# EAGLE design MQ303A + EEPROM v3.0 - para testes (EAGLE 9.6.2)
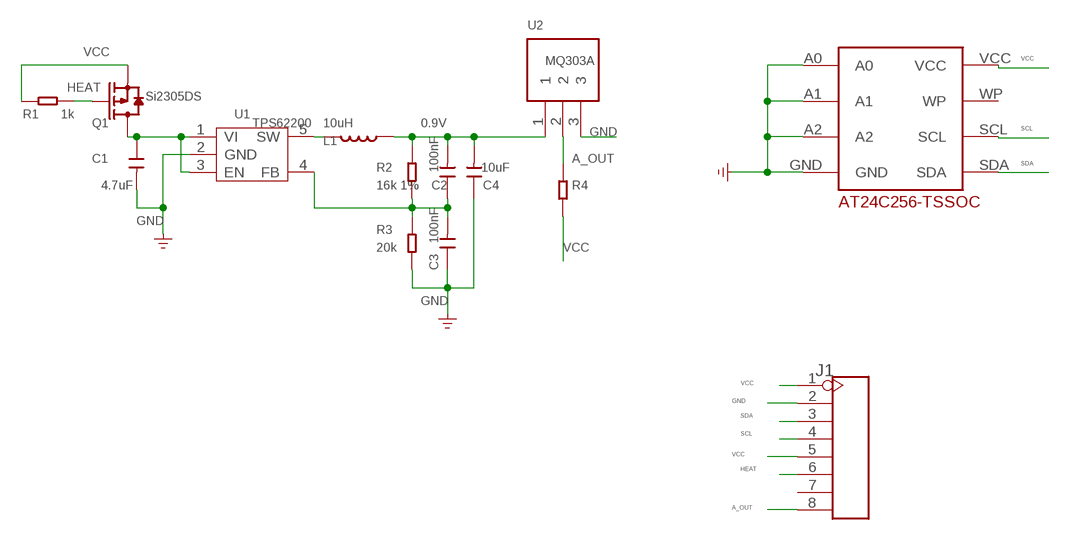
[diagram p0: schematic, sheet 1]

## Parts
C1  4.7uF  C-0805  [C0805]
C2  100nF  C-0603  [C0603]
C3  100nF  C-0603  [C0603]
C4  10uF  C-0805  [C0805]
J1  HEADER-8P-2.54  [8P-2.54]
L1  10uH  L'PIO73'  [PIO73]
Q1  Si2305DS  MOSFET-P'SI2323CDS/SI2305DS<BR>'  [SOT23]
R1  1k  R-0603  [R0603]
R2  16k 1%  R-0603  [R0603]
R3  20k  R-0603  [R0603]
R4  R-0603  [R0603]
U1  TPS62200  TPS62200DBV  [SOT23-5]
U2  MQ303A  [MQ303A]
U$1  DECADE-AT24C256-10TI-2.7  [DECADE-AT24CXX]

## Nets
0.9V: C2.2 C4.2 L1.2 R2.1 U2.1
A_OUT: J1.8 R4.1 U2.2
GND: C1.2 C3.1 C4.1 J1.2 R3.2 U1.2(GND) U2.3 U$1.A0 U$1.A1 U$1.A2 U$1.GND
HEAT: J1.6 Q1.1(G) R1.1
N$1: C1.1 Q1.3(D) U1.1(VI) U1.3(EN)
N$2: L1.1 U1.5(SW)
N$3: C2.1 C3.2 R2.2 R3.1 U1.4(FB)
SCL: J1.4 U$1.SCL
SDA: J1.3 U$1.SDA
VCC: J1.1 J1.5 Q1.2(S) R1.2 R4.2 U$1.VCC
Unconnected: J1.7 U$1.WP

## Library data of the parts
C1-C4 = Discrete:C*: Ceramic Capacitors
J1 = Connector:HEADER-8P
L1 = Discrete:L*
Q1 = Discrete:MOSFET-P
R1-R4 = Discrete:R*
U1 = IC:TPS62200: High-Efficiency,SOT23 STEP-DOWN,DC-DC Converter
U2 = MQ303A:MQ303A
U$1 = DECADE-libraries20151104:DECADE-AT24C256-10TI-2.7

## Board
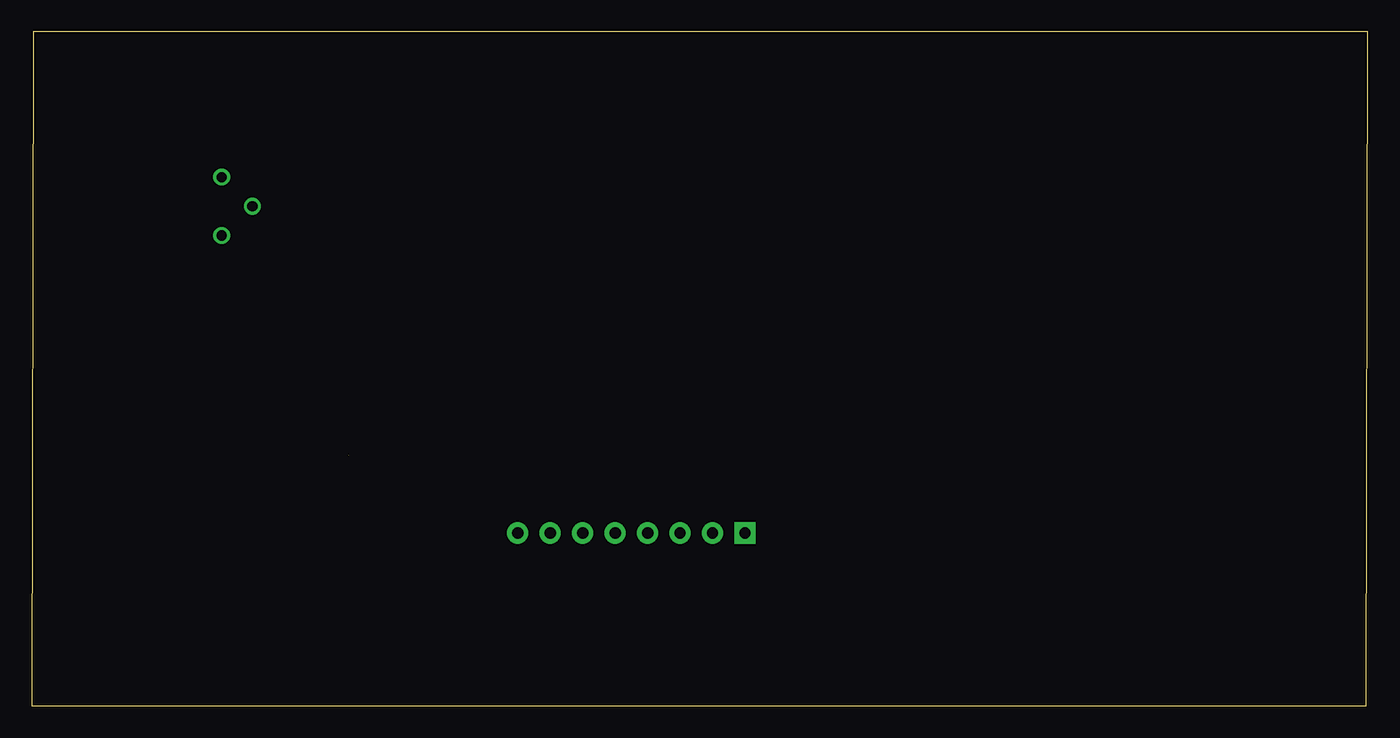
[diagram p1: board, top side]
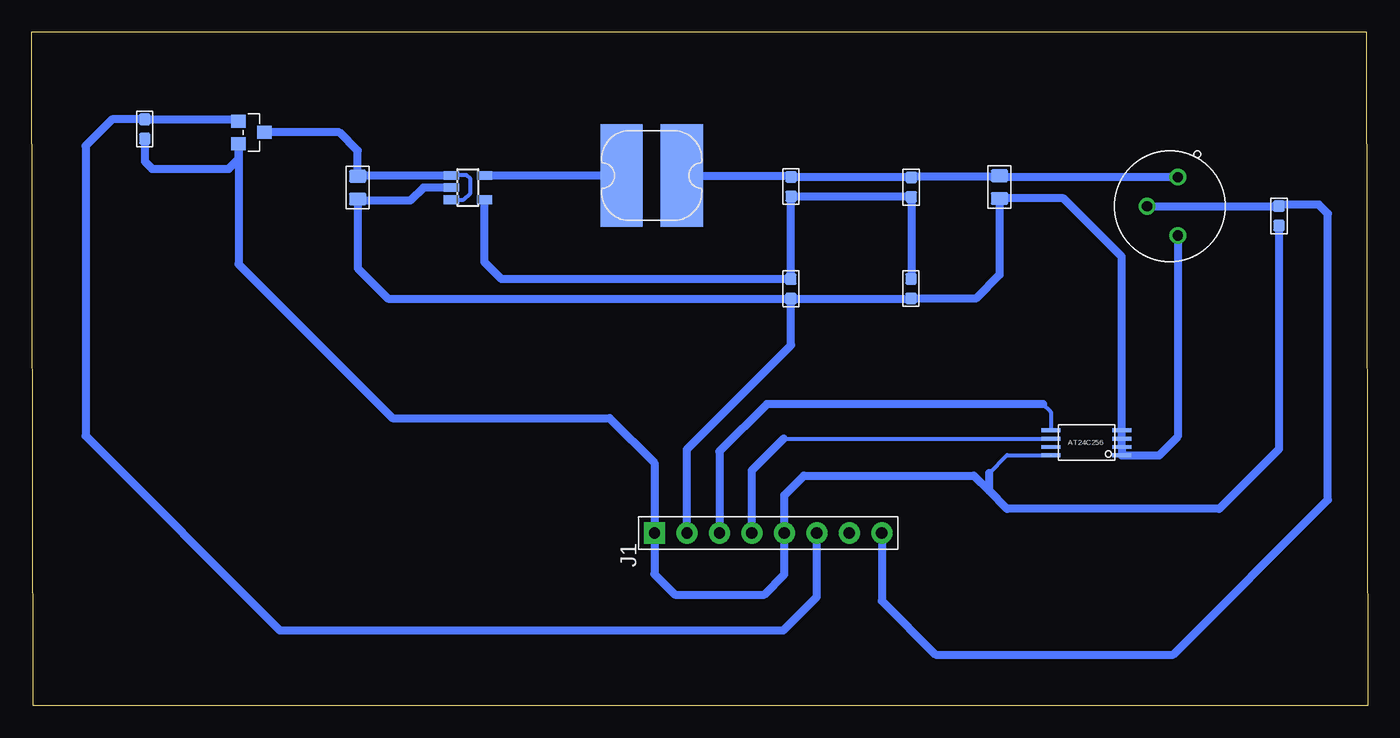
[diagram p2: board, bottom side, seen from below]

Size 104.5 x 52.7 mm. Coordinates in mm from the lower left corner, seen from the top.
Outline: 0,0 104.4,0 104.5,52.7 0.1,52.7 0,0
Copper layers (1*16): Top 0.035mm / dielectric 1.5mm / Bottom 0.035mm
Design rules "default": minimum track width 6mil, minimum drill 0.35mm, track to track 6mil, track to pad 6mil, pad to pad 6mil, via to via 6mil, smd to smd 6mil, copper to edge 40mil, drill to drill 6mil, minimum pad ring 10mil, minimum via ring 8mil, stop-mask expansion 4mil, vias tented up to drill 0mil, thermal gap 10mil

### Footprints (pad centres in the part's own frame; a part is rotated, then mirrored left to right if it is on the bottom)
C0805 = smd 1.016 x 1.397: 1 -0.889,0; 2 0.889,0
C0603 = smd 0.889 x 0.889: 1 -0.762,0; 2 0.762,0
8P-2.54 = drill 0.889 pad 1.651 square: 1 0,8.89 | drill 0.889 pad 1.651: 2 0,6.35; 3 0,3.81; 4 0,1.27; 5 0,-1.27; 6 0,-3.81; 7 0,-6.35; 8 0,-8.89
PIO73 = smd 8 x 3.3: 1 0,2.35; 2 0,-2.35
SOT23 = smd 1.016 x 1.143: 1 -0.889,-1.016; 2 0.889,-1.016; 3 0,1.016
R0603 = smd 0.889 x 0.889: 1 -0.762,0; 2 0.762,0
SOT23-5 = smd 0.69 x 1.2: 1 -0.95,-1.3; 2 0,-1.3; 3 0.95,-1.3; 4 0.95,1.3; 5 -0.95,1.3
MQ303A = drill 0.8: 1 -2.286,0.635; 2 0,-1.778; 3 2.286,0.635
DECADE-AT24CXX = smd 1.5 x 0.3: A0 -2.75,1; A1 -2.75,0.35; A2 -2.75,-0.3; GND -2.75,-0.95; SCL 2.8,-0.3; SDA 2.8,-0.95; VCC 2.8,1; WP 2.8,0.35

### Placement (x,y rotation side)
C1  79.01,40.53 270 bottom
C2  35.7,40.56 90 bottom
C3  35.72,32.63 90 bottom
C4  28.8,40.57 90 bottom
J1  46.9,13.51 90 bottom
L1  56.01,41.47 90 bottom
Q1  87.32,44.84 270 bottom
R1  95.67,45.11 270 bottom
R2  45.11,40.61 270 bottom
R3  45.12,32.61 270 bottom
R4  6.93,38.31 270 bottom
U1  70.39,40.53 270 bottom
U2  15.48,39.06 270 bottom
U$1  21.98,20.59 180 bottom

### Tracks (layer width: path | path; a pad name or v marks a point on that pad's centre or on a via)
0.9V
  Bottom 0.61: L1.2 45.21,41.47 R2.1 35.75,41.37 | 35.75,41.37 C2.2 | C4.2 28.89,41.37 | 28.89,41.37 35.75,41.37 | U2.1 28.86,41.35 28.89,41.37
A_OUT
  Bottom 0.61: U2.2 17.25,39.07 7.3,39.07 | 7.3,39.07 R4.1 | J1.8 38.01,8.21 33.8,4 15.2,4 3.1,16.1 3.1,38.5 3.8,39.2 7.17,39.2 7.3,39.07
GND
  Bottom 0.61: 35.74,31.85 R3.2 45.2,31.85 | 35.74,31.85 C3.1 | 35.74,31.85 30.65,31.85 28.8,33.7 C4.1 23.78,39.68 19.23,35.13 U$1.GND U$1.A2 U$1.A1 U$1.A0 16.31,19.59 14.85,21.05 U2.3 | U1.2 73.87,40.53 74.9,39.5 78.87,39.5 C1.2 79.01,34.21 76.65,31.85 45.2,31.85 | J1.2 53.25,20.05 45.1,28.2 45.1,31.75 45.2,31.85
HEAT
  Bottom 0.61: Q1.1 88.48,45.87 R1.1 98.23,45.87 100.3,43.8 100.3,21.1 85.1,5.9 45.7,5.9 43.09,8.51 J1.6
N$1
  Bottom 0.305: U1.3 70.72,39.58 70.2,40.1 70.2,41.2 70.5,41.5 71.67,41.5 U1.1
  Bottom 0.61: Q1.3 80.44,44.84 79.01,43.41 C1.1 78.95,41.48 U1.1
N$2
  Bottom 0.61: U1.5 L1.1
N$3
  Bottom 0.61: U1.4 69.1,34.7 67.77,33.37 R3.1 45.12,39.84 R2.2 35.75,39.85 C2.1 35.7,33.41 C3.2
SCL
  Bottom 0.305: 45.69,20.89 U$1.SCL
  Bottom 0.61: J1.4 48.17,18.41 45.69,20.89
SDA
  Bottom 0.305: U$1.SDA 24.78,22.98 25.4,23.6
  Bottom 0.61: 25.4,23.6 47,23.6 50.71,19.89 J1.3
VCC  (1 unrouted)
  Bottom 0.305: 29.6,18.2 28.2,19.6 U$1.VCC
  Bottom 0.61: R1.2 95.67,42.57 95.1,42 89.1,42 88.34,42.76 Q1.2 88.34,34.54 76.3,22.5 59.3,22.5 55.79,18.99 J1.1 55.79,10.29 54.2,8.7 47.2,8.7 45.63,10.27 J1.5 45.63,16.47 44.1,18 30.8,18 29.6,16.8 | R4.2 6.93,20.07 11.6,15.4 28.2,15.4 29.6,16.8 | 29.6,16.8 29.6,18.2